# EAGLE design usb2rs232 (EAGLE 6.5.0)
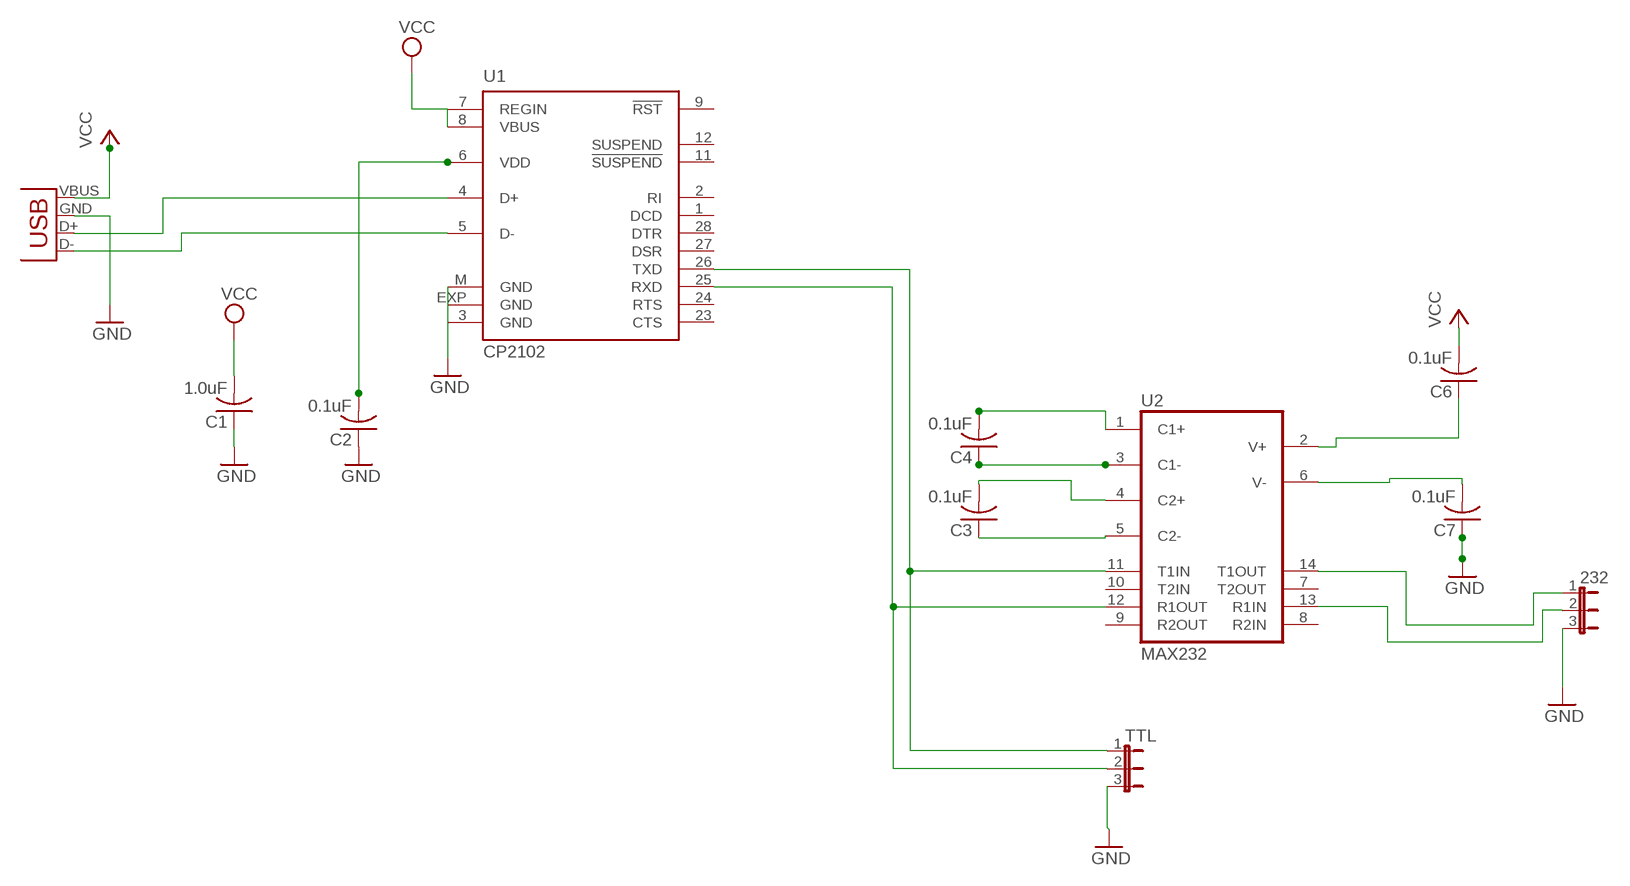
[diagram p0: schematic, sheet 1]

## Parts
232  JP2E  [JP2]
C1  1.0uF  C-USC0603  [C0603]
C2  0.1uF  C-USC0603  [C0603]
C3  0.1uF  C-USC0603  [C0603]
C4  0.1uF  C-USC0603  [C0603]
C6  0.1uF  C-USC0603  [C0603]
C7  0.1uF  C-USC0603  [C0603]
JP3  USB-A-H  [USB-A-H]
TTL  JP2E  [JP2]
U1  CP2102  [MLP28]
U2  MAX232  [SO16]

## Nets
GND: 232.3 C1.1 C2.1 C7.1 JP3.GND(VBUS) TTL.3 U1.3(GND) U1.EXP(GND) U1.M(GND)
N$2: TTL.1 U1.26(TXD) U2.11(T1IN)
N$3: C4.2 U2.1(C1+)
N$4: C4.1 U2.3(C1-)
N$5: JP3.D+(D-) U1.4(D+)
N$6: JP3.D-(D+) U1.5(D-)
N$7: C3.2 U2.4(C2+)
N$8: C3.1 U2.5(C2-)
N$9: C6.1 U2.2(V+)
N$12: C7.2 U2.6(V-)
N$13: 232.1 U2.14(T1OUT)
N$14: 232.2 U2.13(R1IN)
N$15: C2.2 U1.6(VDD)
N$16: TTL.2 U1.25(RXD) U2.12(R1OUT)
VCC: C1.2 C6.2 JP3.VBUS(GND) U1.7(REGIN) U1.8(VBUS)
Unconnected: U1.1(DCD) U1.2(RI) U1.9(!RST) U1.11(!SUSPEND) U1.12(SUSPEND) U1.23(CTS) U1.24(RTS) U1.27(DSR) U1.28(DTR) U2.7(T2OUT) U2.8(R2IN) U2.9(R2OUT) U2.10(T2IN)

## Power pins joined to a net without a drawn wire
GND: U2.15(GND)
VCC: U2.16(VCC)

## Library data of the parts
232 TTL = jumper:JP2E: JUMPER
C1-C4 C6 C7 = rcl:C-US: CAPACITOR, American symbol
JP3 = SparkFun-Connectors:USB: USB Connectors USB-B-PTH is fully proven SKU : PRT-00139/CONN-08278 USB-miniB is fully proven SKU : PRT-00587 USB-A-PCB is untested. USB-A-H is throughly reviewed, but untested. Spark Fun Electronics SKU : PRT-00437 USB-B-SMT is throughly reviewed, but untested. Needs silkscreen touching up. USB-A-S has not been used/tested USB-MB-H has not been used/tested USB-MICROB has been used. CONN-09505
U1 = silabs:CP210*: Single-Chip USB to UART Bridge Source: www.silabs.com .. CP2101.pdf / cp2102.pdf; MF: FARNELL; MPN: CP2102-GM; OC_FARNELL: 9282130; OC_NEWARK: 30K5635
U2 = maxim:MAX232: RS232 TRANSCEIVER; MF: MAXIM; MPN: MAX232ACPE+; OC_FARNELL: 9723773; OC_NEWARK: 68K4544

## Board
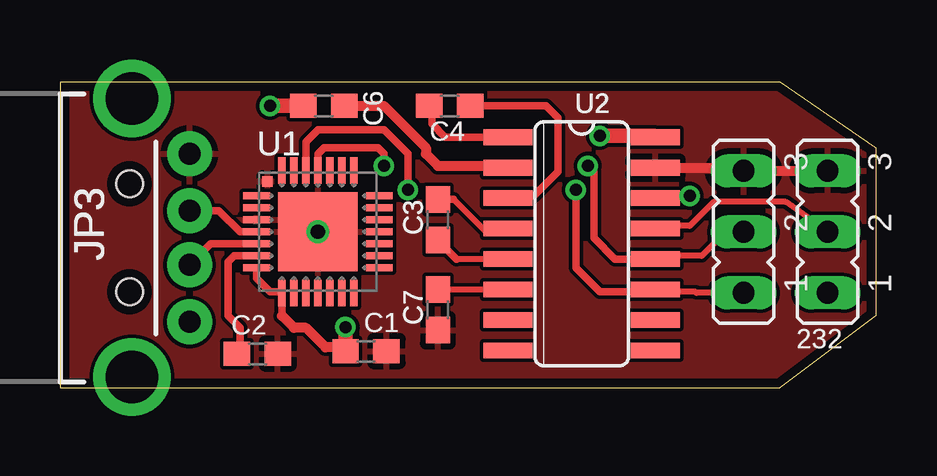
[diagram p1: board, top side]
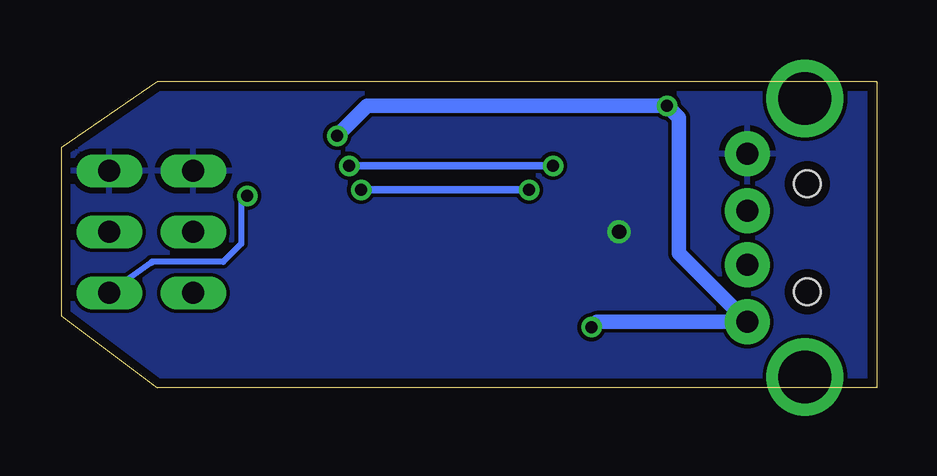
[diagram p2: board, bottom side, seen from below]

Size 34 x 12.75 mm. Coordinates in mm from the lower left corner, seen from the top.
Outline: 0,12.75 30,12.75 34,10 34,3 30,0 0,0 0,12.75
Copper layers (1*16): Top 0.0356mm / dielectric 1.5011mm / Bottom 0.0356mm
Design rules "LaenPCBOrder *": minimum track width 6mil, minimum drill 13mil, track to track 6mil, track to pad 6mil, pad to pad 6mil, via to via 6mil, smd to smd 6mil, copper to edge 15mil, drill to drill 6mil, minimum pad ring 7mil, minimum via ring 7mil, stop-mask expansion 4mil, vias tented up to drill 0mil, thermal gap 10mil

### Footprints (pad centres in the part's own frame; a part is rotated, then mirrored left to right if it is on the bottom)
JP2 = drill 0.914 long: 1 -2.54,0; 2 0,0; 3 2.54,0
C0603 = smd 1.1 x 1: 1 -0.85,0; 2 0.85,0
USB-A-H = drill 0.914 pad 1.88: D+ 2.4,1.127; D- 2.4,-1.127; GND 2.4,3.5; VBUS 2.4,-3.5 | drill 2.2: GND2 0,-5.8; GND3 0,5.8 | hole 1.1: -0.1,2.25; -0.1,-2.25
MLP28 = smd 1.108 x 0.3: 1 -2.554,1.5; 2 -2.554,1; 3 -2.554,0.5; 4 -2.554,0; 5 -2.554,-0.5; 6 -2.554,-1; 7 -2.554,-1.5; 15 2.554,-1.5; 16 2.554,-1; 17 2.554,-0.5; 18 2.554,0; 19 2.554,0.5; 20 2.554,1; 21 2.554,1.5 | smd 0.3 x 1.108: 8 -1.5,-2.554; 9 -1,-2.554; 10 -0.5,-2.554; 11 0,-2.554; 12 0.5,-2.554; 13 1,-2.554; 14 1.5,-2.554; 22 1.5,2.554; 23 1,2.554; 24 0.5,2.554; 25 0,2.554; 26 -0.5,2.554; 27 -1,2.554; 28 -1.5,2.554 | smd 3.3 x 3.3: EXP 0,0 | smd 0.435 x 0.435: M -2.103,2.103
SO16 = smd 0.66 x 2.032: 1 -4.445,-3.073; 2 -3.175,-3.073; 3 -1.905,-3.073; 4 -0.635,-3.073; 5 0.635,-3.073; 6 1.905,-3.073; 7 3.175,-3.073; 8 4.445,-3.073; 9 4.445,3.073; 10 3.175,3.073; 11 1.905,3.073; 12 0.635,3.073; 13 -0.635,3.073; 14 -1.905,3.073; 15 -3.175,3.073; 16 -4.445,3.073

### Placement (x,y rotation side)
232  32,6.5 90 top
C1  12.76,1.52 180 top
C2  8.23,1.42 180 top
C3  15.75,7 90 top
C4  16.25,11.75 180 top
C6  11,11.75 180 top
C7  15.75,3.25 90 top
JP3  3,6.25 0 top
TTL  28.5,6.5 90 top
U1  10.75,6.5 0 top
U2  21.75,6 270 top

### Tracks (layer width: path | path; a pad name or v marks a point on that pad's centre or on a via)
GND  (via drill 0.6)
  Top 0.406: U2.15 28.86,9.17 TTL.3 232.3
  other vias: 10.75,6.5
  pour Top: 0,12.75 30,12.75 34,10 34,3 30,0 0,0
  pour Bottom: 0,12.75 30,12.75 34,10 34,3 30,0 0,0
N$2  (via drill 0.5 pad 0.61)
  Top 0.254: TTL.1 26.54,3.96 26.5,4 24.92,4 U2.11
  Top 0.305: U1.26 10.25,10.25 10.75,10.75 13.5,10.75 14.5,9.75 v14.5,8.25 | v21.5,8.25 21.5,5 22.5,4 24.73,4 U2.11
  Bottom 0.305: v14.5,8.25 v21.5,8.25
N$3
  Top 0.305: U2.1 16.05,10.45 15.5,11 15.5,11.65 C4.2
N$4
  Top 0.305: U2.3 18.77,8 19.75,8 20.75,9 20.75,11.25 20.25,11.75 C4.1
N$5
  Top 0.305: JP3.D+ 6.62,7.38 7.5,6.5 U1.4
N$6
  Top 0.305: U1.5 6.28,6 JP3.D-
N$7
  Top 0.254: 16.4,7.85 17.75,6.5 18.54,6.5 U2.4
  Top 0.305: 16.4,7.85 C3.2
N$8
  Top 0.254: U2.5 16.54,5.37
  Top 0.305: 16.54,5.37 C3.1
N$9
  Top 0.406: C6.1 13.5,11.75 15.25,10 15.25,9.75 15.75,9.25 18,9.25 18.07,9.17 U2.2
N$12
  Top 0.254: U2.6 C7.2
N$13  (via drill 0.5 pad 0.61)
  Top 0.254: v26.25,8 25,8 24.91,7.91 U2.14
  Bottom 0.254: v26.25,8 26.5,7.75 26.5,6 27.25,5.25 30.25,5.25 30.25,5.21 232.1
N$14
  Top 0.254: 232.2 30.25,7.75 27.25,7.75 26.25,6.75 24.94,6.75 U2.13
N$15
  Top 0.305: U1.6 7.25,5.5 7,5.25 7,3 7.5,2.5 7.5,1.54 C2.2
N$16  (via drill 0.5 pad 0.61)
  Top 0.254: TTL.2 27.75,6.5 26.75,5.5 24.96,5.5 U2.12
  Top 0.305: U2.12 23.14,5.37 22.25,6.25 22.25,9 v22,9.25 | 10.75,9.25 U1.25 10.75,9.75 11,10 13.25,10 13.5,9.75 v13.5,9.25
  Bottom 0.305: v22,9.25 v13.5,9.25
VCC  (via drill 0.5 pad 0.61)
  Top 0.305: 12,1.68 C1.2 | U1.7 8.2,4.55 8.75,4 9.2,4 U1.8 9.25,3
  Top 0.406: 12,1.68 11.07,1.68 10.25,2.5 9.75,2.5 9.25,3
  Top 0.61: v11.9,2.52 C1.2 | C6.2 v8.75,11.75 | v22.5,10.5 24.77,10.5 U2.16
  Bottom 0.61: v22.5,10.5 21.25,11.75 v8.75,11.75 8.25,11.25 8.25,5.6 JP3.VBUS 11.68,2.75 v11.9,2.52

### Text on the board
_tsilk: GND | RX | TX
_tNames: C6 | C6 | C6 | C4 | U2 | U2 | U2 | U2 | U2 | U2 | U2 | U2 | U1 | U1 | U1 | C3 | C3 | C3 | C3 | C3 | C3 | C3 | C3 | JP3 | JP3 | JP3 | JP3 | JP3 | JP3 | JP3 | JP3 | C2 | C1 | C7 | C7 | C7 | C7 | C7 | C7 | C7 | C7 | 232